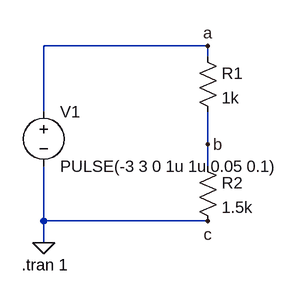
[diagram p0: schematic Draft1.asc]
Draft1.asc, the LTspice schematic file:
Version 4
SHEET 1 880 680
WIRE 304 32 64 32
WIRE 304 48 304 32
WIRE 64 128 64 32
WIRE 304 176 304 128
WIRE 304 208 304 176
WIRE 64 288 64 208
WIRE 304 288 64 288
WIRE 64 320 64 288
FLAG 64 320 0
FLAG 304 32 a
FLAG 304 176 b
FLAG 304 288 c
SYMBOL voltage 64 112 R0
WINDOW 123 0 0 Left 0
WINDOW 39 0 0 Left 0
SYMATTR InstName V1
SYMATTR Value PULSE(-3 3 0 1u 1u 0.05 0.1)
SYMBOL res 288 32 R0
SYMATTR InstName R1
SYMATTR Value 1k
SYMATTR SpiceLine tol=5 pwr=0.1
SYMBOL res 288 192 R0
SYMATTR InstName R2
SYMATTR Value 1.5k
SYMATTR SpiceLine tol=5 pwr=0.1
TEXT 32 352 Left 2 !.tran 1

The netlist it stands for:
* Draft1.asc
V1 a 0 PULSE(-3 3 0 1u 1u 0.05 0.1)
R1 a b 1k tol=5 pwr=0.1
R2 b 0 1.5k tol=5 pwr=0.1
.tran 1
.backanno
.end

* Results of the author's LTspice run, read from the files saved beside the schematic
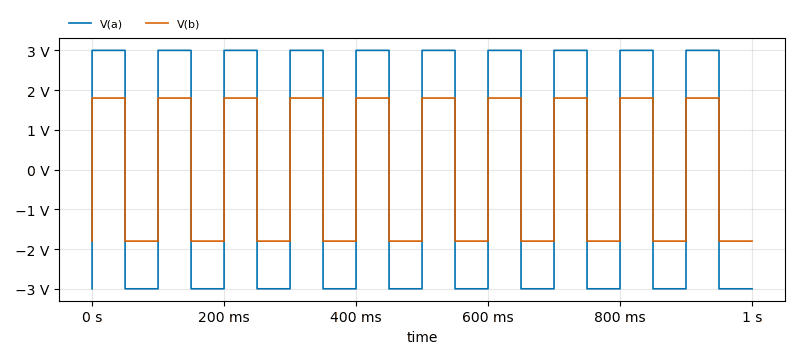
[diagram p1: Transient Analysis of Draft1.asc, plotted from the saved traces]
* Transient Analysis, 1 run:
*   V(a): min -3 V, max 3 V, average 60 µV, rms 3 V, last -3 V
*   V(b): min -1.8 V, max 1.8 V, average 36 µV, rms 1.8 V, last -1.8 V